# Altium schematic sheet SH11 - OMAP-L137 POWER.SchDoc
size 386 x 246 mm
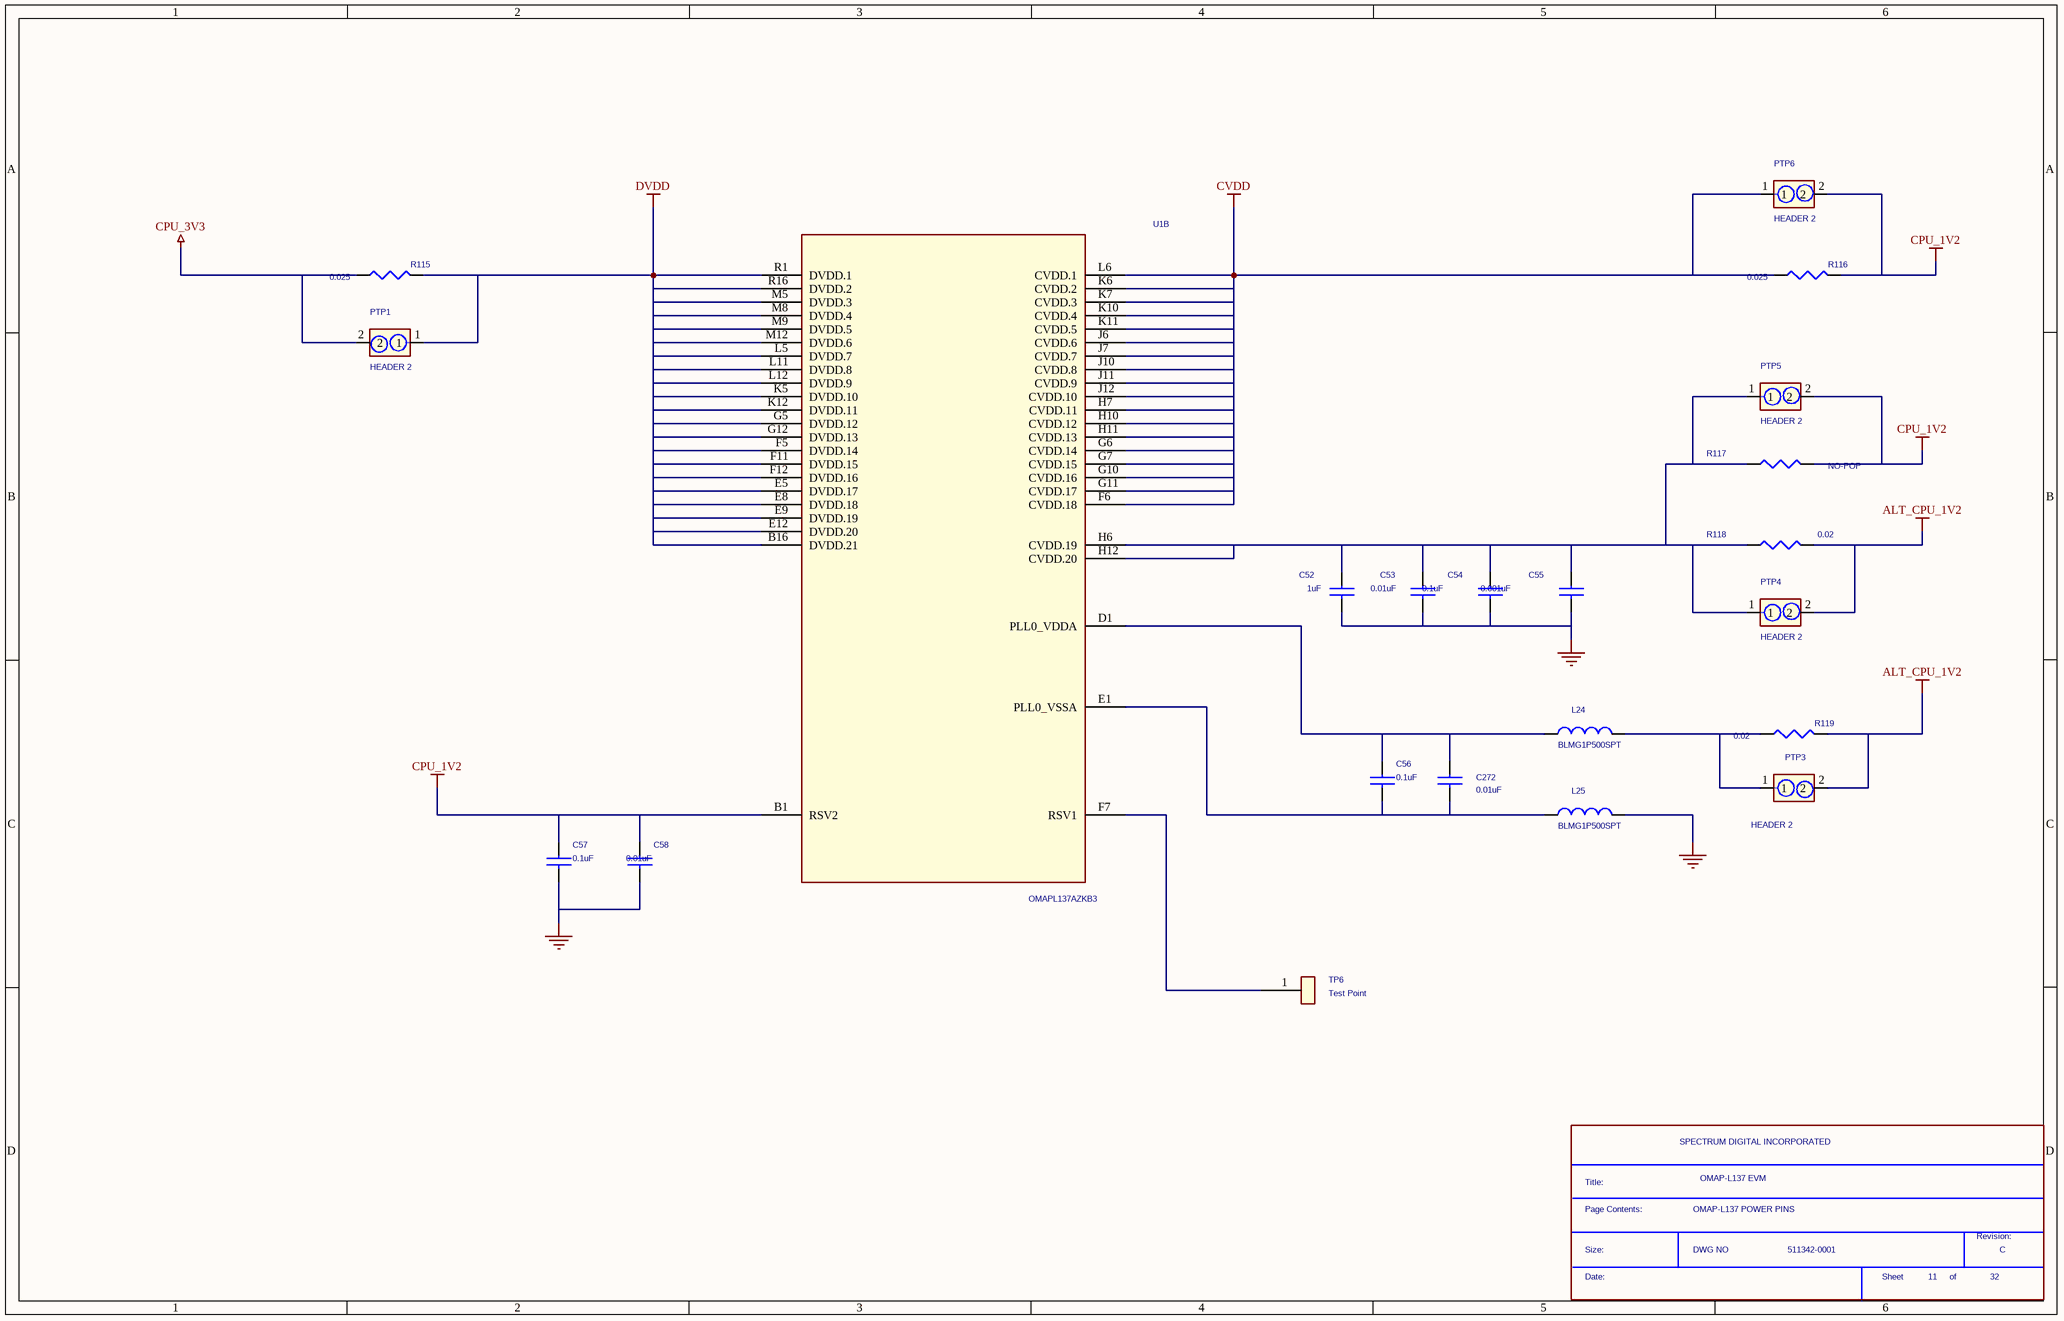
[diagram p0: SH11 - OMAP-L137 POWER.SchDoc]

## Parts
*  Page Contents:: OMAP-L137 POWER PINS  RevCode: C  Title: OMAP-L137 EVM  OrgName: SPECTRUM DIGITAL INCORPORATED  Doc: 511342-0001  Page Number: 11  Page Count: 32  (hidden comment: SDTitleBlock)  (graphical)
C52  1uF  [c603-35x45]
C53  0.01uF  [c402-25]
C54  0.1uF  [c402-25]
C55  0.001uF  [c402-25]
C56  0.1uF  [c402-25]
C57  0.1uF  [c402-25]
C58  0.01uF  [c402-25]
C272  0.01uF  [c402-25]
L24  BLMG1P500SPT  [emi-blm31p-40x70]
L25  BLMG1P500SPT  [emi-blm31p-40x70]
PTP1  HEADER 2  [JUMP1X2-6040]
PTP3  HEADER 2  [JUMP1X2-6040]
PTP4  HEADER 2  [JUMP1X2-6040]
PTP5  HEADER 2  [JUMP1X2-6040]
PTP6  HEADER 2  [JUMP1X2-6040]
R115  0.025  [r2512]
R116  0.025  [r2512]
R117  NO-POP  [r402-25]
R118  0.02  [r1206-40x70]
R119  0.02  [r1206-40x70]
TP6  Test Point  [tp1-6040]
U1  OMAPL137AZKB3  [skt256-6064]  (part B of 9)

## Nets
ALT_CPU_1V2: PTP3.2 PTP4.2 R118.2 R119.1
CPU_1V2: C57.1 C58.1 PTP5.2 PTP6.2 R116.1 R117.1 U1.B1(RSV2)
CPU_3V3: PTP1.2 R115.2
CVDD: PTP6.1 R116.2 U1.F6(CVDD.18) U1.G6(CVDD.14) U1.G7(CVDD.15) U1.G10(CVDD.16) U1.G11(CVDD.17) U1.H7(CVDD.11) U1.H10(CVDD.12) U1.H11(CVDD.13) U1.J6(CVDD.6) U1.J7(CVDD.7) U1.J10(CVDD.8) U1.J11(CVDD.9) U1.J12(CVDD.10) U1.K6(CVDD.2) U1.K7(CVDD.3) U1.K10(CVDD.4) U1.K11(CVDD.5) U1.L6(CVDD.1)
DVDD: PTP1.1 R115.1 U1.B16(DVDD.21) U1.E5(DVDD.17) U1.E8(DVDD.18) U1.E9(DVDD.19) U1.E12(DVDD.20) U1.F5(DVDD.14) U1.F11(DVDD.15) U1.F12(DVDD.16) U1.G5(DVDD.12) U1.G12(DVDD.13) U1.K5(DVDD.10) U1.K12(DVDD.11) U1.L5(DVDD.7) U1.L11(DVDD.8) U1.L12(DVDD.9) U1.M5(DVDD.3) U1.M8(DVDD.4) U1.M9(DVDD.5) U1.M12(DVDD.6) U1.R1(DVDD.1) U1.R16(DVDD.2)
GND: C52.2 C53.2 C54.2 C55.2 C57.2 C58.2 L25.2
NetC52_1: C52.1 C53.1 C54.1 C55.1 PTP4.1 PTP5.1 R117.2 R118.1 U1.H6(CVDD.19) U1.H12(CVDD.20)
NetC56_1: C56.1 C272.1 L24.1 U1.D1(PLL0_VDDA)
NetC56_2: C56.2 C272.2 L25.1 U1.E1(PLL0_VSSA)
NetL24_2: L24.2 PTP3.1 R119.2
NetTP6_1: TP6.1 U1.F7(RSV1)

## Notes on the sheet
- (in symbol SDTitleBlock) Title:; Page Contents:; Revision:; Size:; DWG NO; Date:; Sheet; of

## Library data of the parts
C52 = CAP NP: Part #: 101007-0100R
C53 C58 C272 = CAP NP: Part #: 101587-1101R
C54 C56 C57 = CAP NP: Part #: 101587-1100R
C55 = CAP NP: Part #: 102058-1102R
L24 L25 = INDUCTOR_0: Part Number: 134; Part #: 102870-5001R
PTP1 PTP3-PTP6 = PTP2: Single Line Header 2pin Tin; NCPartnumber: 2H0000; MfrNum: PTC02SAAN; Mfr: Sullins; Cost10K: 0.252; Vendor: Digikey; Cost100: 0.252; PartName: HEADER2Pin
R115 R116 = R: Part #: 100830-0025R
R117 = R: Part #: R0402-NOPOP
R118 R119 = R: Part #: 102598-0002R
TP6 = TEST POINT: Part #: 100115-0001R
U1 = PRIMUS_BGA_1: Part #: 102772-0001; SWAP_INFO: (S1+S2+S3+S4+S5+S6+S7+S8+S9); SPLIT_INST: TRUE